# Altium schematic sheet clock_led.SchDoc
size A3
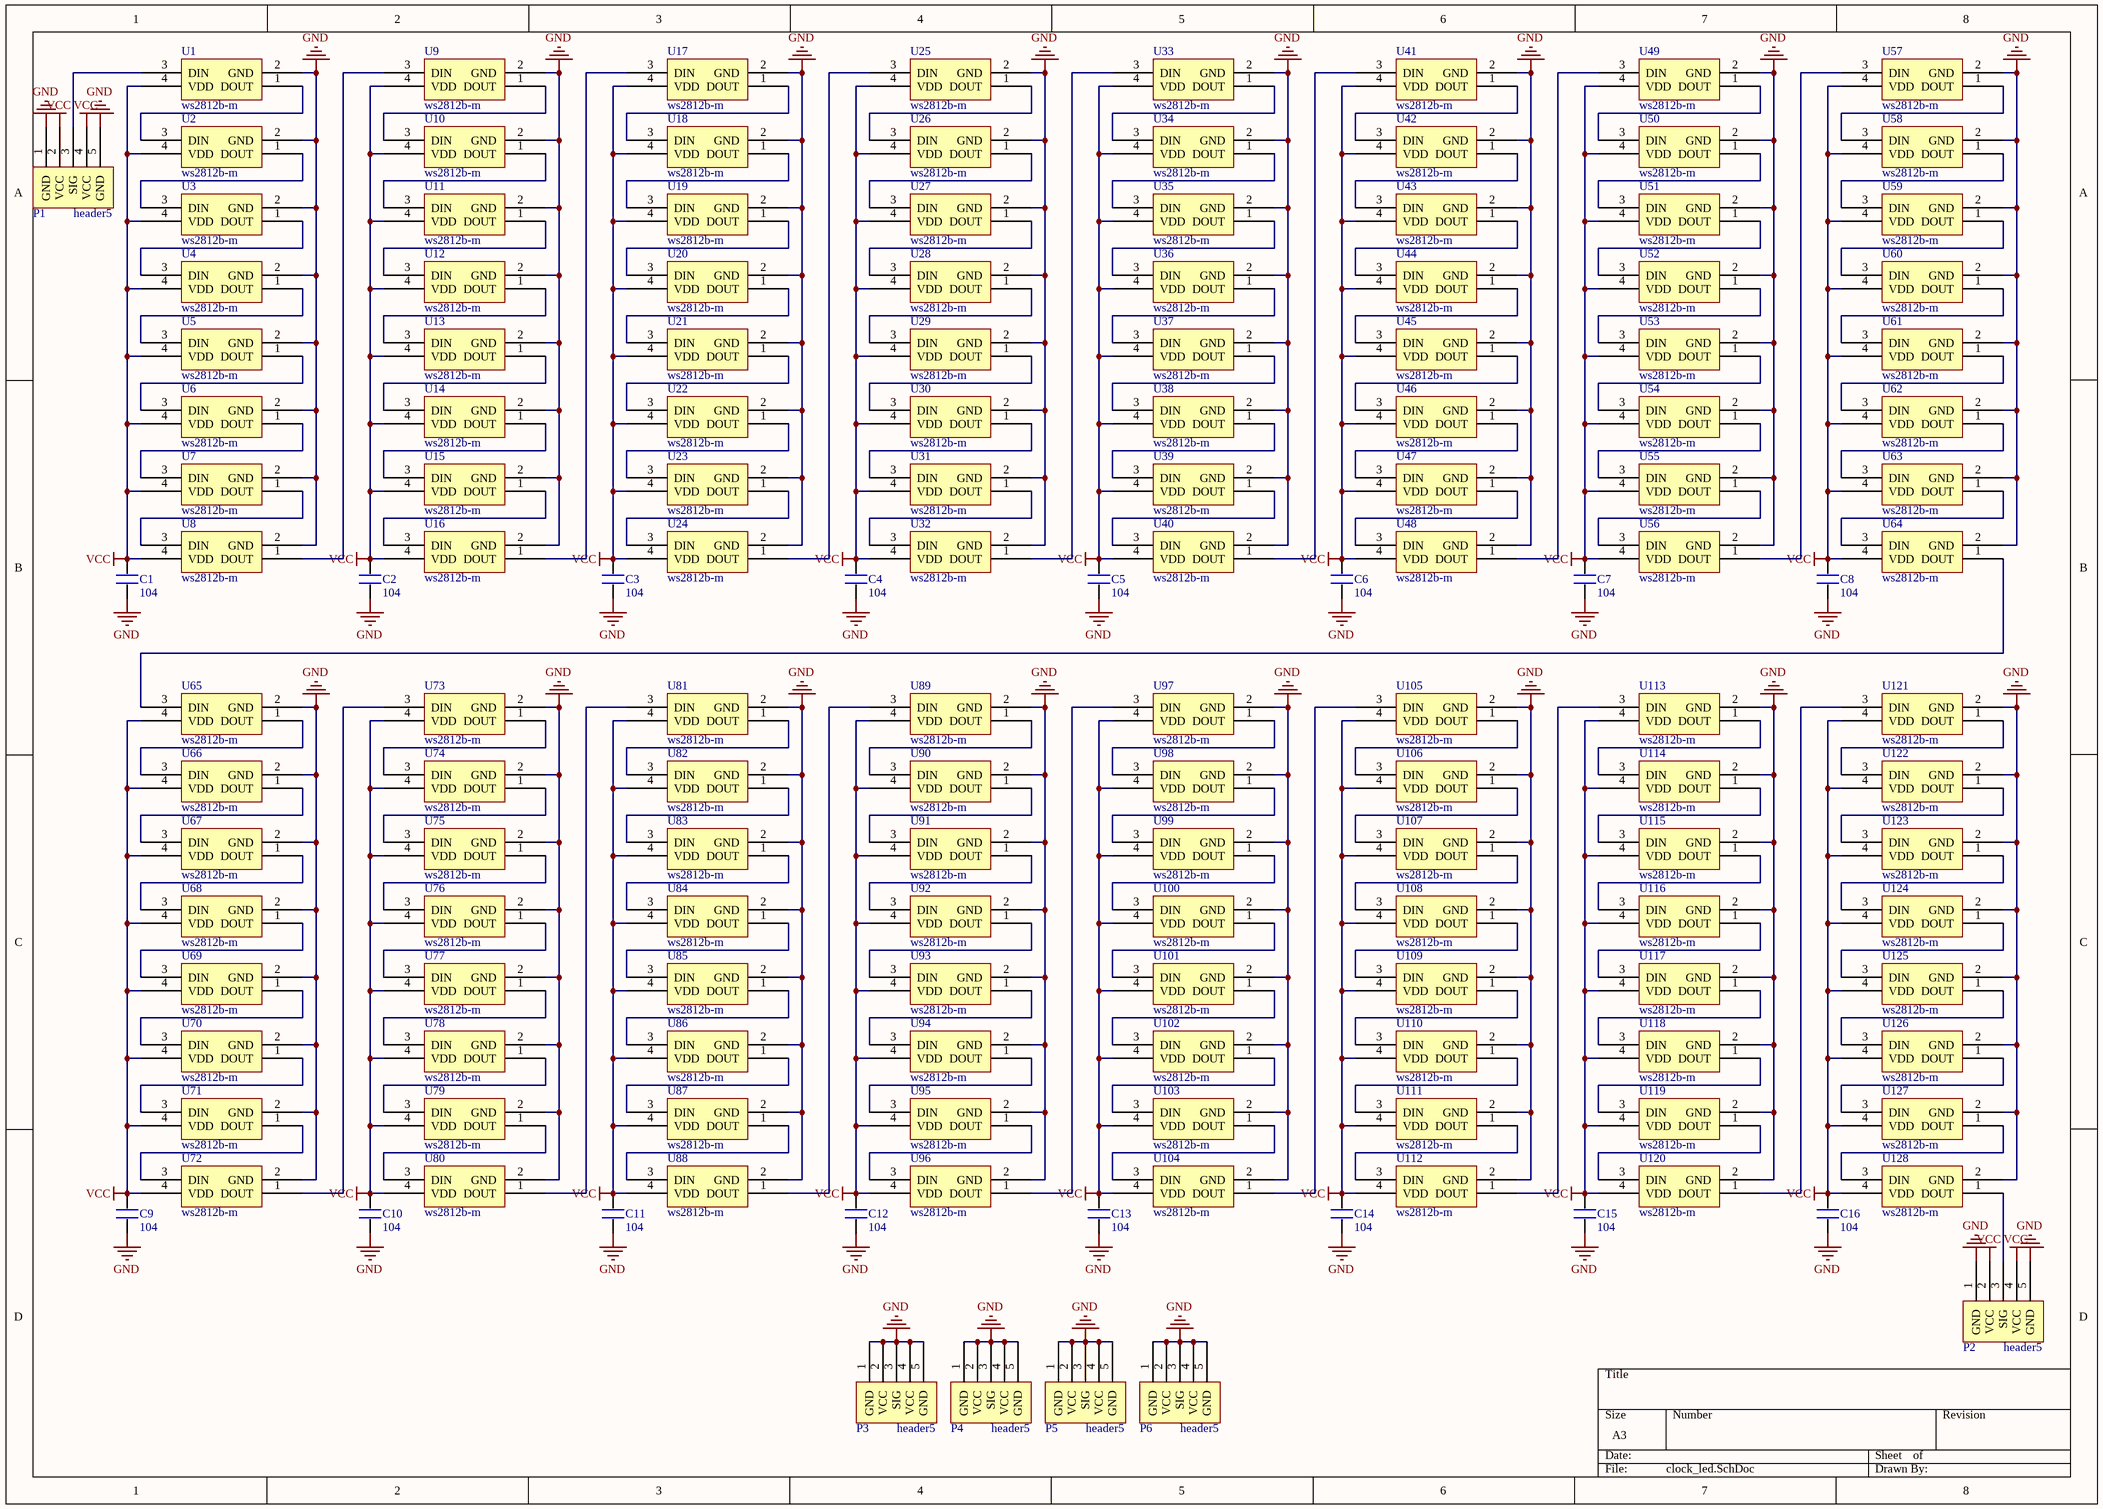
[diagram p0: clock_led.SchDoc]

## Parts
C1  104  [0603P]
C2  104  [0603P]
C3  104  [0603P]
C4  104  [0603P]
C5  104  [0603P]
C6  104  [0603P]
C7  104  [0603P]
C8  104  [0603P]
C9  104  [0603P]
C10  104  [0603P]
C11  104  [0603P]
C12  104  [0603P]
C13  104  [0603P]
C14  104  [0603P]
C15  104  [0603P]
C16  104  [0603P]
P1  header5  [header5]
P2  header5  [header5]
P3  header5  [header5]
P4  header5  [header5]
P5  header5  [header5]
P6  header5  [header5]
U1  ws2812b-m  [WS2812B-MINI]
U2  ws2812b-m  [WS2812B-MINI]
U3  ws2812b-m  [WS2812B-MINI]
U4  ws2812b-m  [WS2812B-MINI]
U5  ws2812b-m  [WS2812B-MINI]
U6  ws2812b-m  [WS2812B-MINI]
U7  ws2812b-m  [WS2812B-MINI]
U8  ws2812b-m  [WS2812B-MINI]
U9  ws2812b-m  [WS2812B-MINI]
U10  ws2812b-m  [WS2812B-MINI]
U11  ws2812b-m  [WS2812B-MINI]
U12  ws2812b-m  [WS2812B-MINI]
U13  ws2812b-m  [WS2812B-MINI]
U14  ws2812b-m  [WS2812B-MINI]
U15  ws2812b-m  [WS2812B-MINI]
U16  ws2812b-m  [WS2812B-MINI]
U17  ws2812b-m  [WS2812B-MINI]
U18  ws2812b-m  [WS2812B-MINI]
U19  ws2812b-m  [WS2812B-MINI]
U20  ws2812b-m  [WS2812B-MINI]
U21  ws2812b-m  [WS2812B-MINI]
U22  ws2812b-m  [WS2812B-MINI]
U23  ws2812b-m  [WS2812B-MINI]
U24  ws2812b-m  [WS2812B-MINI]
U25  ws2812b-m  [WS2812B-MINI]
U26  ws2812b-m  [WS2812B-MINI]
U27  ws2812b-m  [WS2812B-MINI]
U28  ws2812b-m  [WS2812B-MINI]
U29  ws2812b-m  [WS2812B-MINI]
U30  ws2812b-m  [WS2812B-MINI]
U31  ws2812b-m  [WS2812B-MINI]
U32  ws2812b-m  [WS2812B-MINI]
U33  ws2812b-m  [WS2812B-MINI]
U34  ws2812b-m  [WS2812B-MINI]
U35  ws2812b-m  [WS2812B-MINI]
U36  ws2812b-m  [WS2812B-MINI]
U37  ws2812b-m  [WS2812B-MINI]
U38  ws2812b-m  [WS2812B-MINI]
U39  ws2812b-m  [WS2812B-MINI]
U40  ws2812b-m  [WS2812B-MINI]
U41  ws2812b-m  [WS2812B-MINI]
U42  ws2812b-m  [WS2812B-MINI]
U43  ws2812b-m  [WS2812B-MINI]
U44  ws2812b-m  [WS2812B-MINI]
U45  ws2812b-m  [WS2812B-MINI]
U46  ws2812b-m  [WS2812B-MINI]
U47  ws2812b-m  [WS2812B-MINI]
U48  ws2812b-m  [WS2812B-MINI]
U49  ws2812b-m  [WS2812B-MINI]
U50  ws2812b-m  [WS2812B-MINI]
U51  ws2812b-m  [WS2812B-MINI]
U52  ws2812b-m  [WS2812B-MINI]
U53  ws2812b-m  [WS2812B-MINI]
U54  ws2812b-m  [WS2812B-MINI]
U55  ws2812b-m  [WS2812B-MINI]
U56  ws2812b-m  [WS2812B-MINI]
U57  ws2812b-m  [WS2812B-MINI]
U58  ws2812b-m  [WS2812B-MINI]
U59  ws2812b-m  [WS2812B-MINI]
U60  ws2812b-m  [WS2812B-MINI]
U61  ws2812b-m  [WS2812B-MINI]
U62  ws2812b-m  [WS2812B-MINI]
U63  ws2812b-m  [WS2812B-MINI]
U64  ws2812b-m  [WS2812B-MINI]
U65  ws2812b-m  [WS2812B-MINI]
U66  ws2812b-m  [WS2812B-MINI]
U67  ws2812b-m  [WS2812B-MINI]
U68  ws2812b-m  [WS2812B-MINI]
U69  ws2812b-m  [WS2812B-MINI]
U70  ws2812b-m  [WS2812B-MINI]
U71  ws2812b-m  [WS2812B-MINI]
U72  ws2812b-m  [WS2812B-MINI]
U73  ws2812b-m  [WS2812B-MINI]
U74  ws2812b-m  [WS2812B-MINI]
U75  ws2812b-m  [WS2812B-MINI]
U76  ws2812b-m  [WS2812B-MINI]
U77  ws2812b-m  [WS2812B-MINI]
U78  ws2812b-m  [WS2812B-MINI]
U79  ws2812b-m  [WS2812B-MINI]
U80  ws2812b-m  [WS2812B-MINI]
U81  ws2812b-m  [WS2812B-MINI]
U82  ws2812b-m  [WS2812B-MINI]
U83  ws2812b-m  [WS2812B-MINI]
U84  ws2812b-m  [WS2812B-MINI]
U85  ws2812b-m  [WS2812B-MINI]
U86  ws2812b-m  [WS2812B-MINI]
U87  ws2812b-m  [WS2812B-MINI]
U88  ws2812b-m  [WS2812B-MINI]
U89  ws2812b-m  [WS2812B-MINI]
U90  ws2812b-m  [WS2812B-MINI]
U91  ws2812b-m  [WS2812B-MINI]
U92  ws2812b-m  [WS2812B-MINI]
U93  ws2812b-m  [WS2812B-MINI]
U94  ws2812b-m  [WS2812B-MINI]
U95  ws2812b-m  [WS2812B-MINI]
U96  ws2812b-m  [WS2812B-MINI]
U97  ws2812b-m  [WS2812B-MINI]
U98  ws2812b-m  [WS2812B-MINI]
U99  ws2812b-m  [WS2812B-MINI]
U100  ws2812b-m  [WS2812B-MINI]
U101  ws2812b-m  [WS2812B-MINI]
U102  ws2812b-m  [WS2812B-MINI]
U103  ws2812b-m  [WS2812B-MINI]
U104  ws2812b-m  [WS2812B-MINI]
U105  ws2812b-m  [WS2812B-MINI]
U106  ws2812b-m  [WS2812B-MINI]
U107  ws2812b-m  [WS2812B-MINI]
U108  ws2812b-m  [WS2812B-MINI]
U109  ws2812b-m  [WS2812B-MINI]
U110  ws2812b-m  [WS2812B-MINI]
U111  ws2812b-m  [WS2812B-MINI]
U112  ws2812b-m  [WS2812B-MINI]
U113  ws2812b-m  [WS2812B-MINI]
U114  ws2812b-m  [WS2812B-MINI]
U115  ws2812b-m  [WS2812B-MINI]
U116  ws2812b-m  [WS2812B-MINI]
U117  ws2812b-m  [WS2812B-MINI]
U118  ws2812b-m  [WS2812B-MINI]
U119  ws2812b-m  [WS2812B-MINI]
U120  ws2812b-m  [WS2812B-MINI]
U121  ws2812b-m  [WS2812B-MINI]
U122  ws2812b-m  [WS2812B-MINI]
U123  ws2812b-m  [WS2812B-MINI]
U124  ws2812b-m  [WS2812B-MINI]
U125  ws2812b-m  [WS2812B-MINI]
U126  ws2812b-m  [WS2812B-MINI]
U127  ws2812b-m  [WS2812B-MINI]
U128  ws2812b-m  [WS2812B-MINI]

## Nets
GND: C1.1 C2.1 C3.1 C4.1 C5.1 C6.1 C7.1 C8.1 C9.1 C10.1 C11.1 C12.1 C13.1 C14.1 C15.1 C16.1 P1.1(GND) P1.5(GND) P2.1(GND) P2.5(GND) P3.1(GND) P3.2(VCC) P3.3(SIG) P3.4(VCC) P3.5(GND) P4.1(GND) P4.2(VCC) P4.3(SIG) P4.4(VCC) P4.5(GND) P5.1(GND) P5.2(VCC) P5.3(SIG) P5.4(VCC) P5.5(GND) P6.1(GND) P6.2(VCC) P6.3(SIG) P6.4(VCC) P6.5(GND) U1.2(GND) U2.2(GND) U3.2(GND) U4.2(GND) U5.2(GND) U6.2(GND) U7.2(GND) U8.2(GND) U9.2(GND) U10.2(GND) U11.2(GND) U12.2(GND) U13.2(GND) U14.2(GND) U15.2(GND) U16.2(GND) U17.2(GND) U18.2(GND) U19.2(GND) U20.2(GND) U21.2(GND) U22.2(GND) U23.2(GND) U24.2(GND) U25.2(GND) U26.2(GND) U27.2(GND) U28.2(GND) U29.2(GND) U30.2(GND) U31.2(GND) U32.2(GND) U33.2(GND) U34.2(GND) U35.2(GND) U36.2(GND) U37.2(GND) U38.2(GND) U39.2(GND) U40.2(GND) U41.2(GND) U42.2(GND) U43.2(GND) U44.2(GND) U45.2(GND) U46.2(GND) U47.2(GND) U48.2(GND) U49.2(GND) U50.2(GND) U51.2(GND) U52.2(GND) U53.2(GND) U54.2(GND) U55.2(GND) U56.2(GND) U57.2(GND) U58.2(GND) U59.2(GND) U60.2(GND) U61.2(GND) U62.2(GND) U63.2(GND) U64.2(GND) U65.2(GND) U66.2(GND) U67.2(GND) U68.2(GND) U69.2(GND) U70.2(GND) U71.2(GND) U72.2(GND) U73.2(GND) U74.2(GND) U75.2(GND) U76.2(GND) U77.2(GND) U78.2(GND) U79.2(GND) U80.2(GND) U81.2(GND) U82.2(GND) U83.2(GND) U84.2(GND) U85.2(GND) U86.2(GND) U87.2(GND) U88.2(GND) U89.2(GND) U90.2(GND) U91.2(GND) U92.2(GND) U93.2(GND) U94.2(GND) U95.2(GND) U96.2(GND) U97.2(GND) U98.2(GND) U99.2(GND) U100.2(GND) U101.2(GND) U102.2(GND) U103.2(GND) U104.2(GND) U105.2(GND) U106.2(GND) U107.2(GND) U108.2(GND) U109.2(GND) U110.2(GND) U111.2(GND) U112.2(GND) U113.2(GND) U114.2(GND) U115.2(GND) U116.2(GND) U117.2(GND) U118.2(GND) U119.2(GND) U120.2(GND) U121.2(GND) U122.2(GND) U123.2(GND) U124.2(GND) U125.2(GND) U126.2(GND) U127.2(GND) U128.2(GND)
VCC: C1.2 C2.2 C3.2 C4.2 C5.2 C6.2 C7.2 C8.2 C9.2 C10.2 C11.2 C12.2 C13.2 C14.2 C15.2 C16.2 P1.2(VCC) P1.4(VCC) P2.2(VCC) P2.4(VCC) U1.4(VDD) U2.4(VDD) U3.4(VDD) U4.4(VDD) U5.4(VDD) U6.4(VDD) U7.4(VDD) U8.4(VDD) U9.4(VDD) U10.4(VDD) U11.4(VDD) U12.4(VDD) U13.4(VDD) U14.4(VDD) U15.4(VDD) U16.4(VDD) U17.4(VDD) U18.4(VDD) U19.4(VDD) U20.4(VDD) U21.4(VDD) U22.4(VDD) U23.4(VDD) U24.4(VDD) U25.4(VDD) U26.4(VDD) U27.4(VDD) U28.4(VDD) U29.4(VDD) U30.4(VDD) U31.4(VDD) U32.4(VDD) U33.4(VDD) U34.4(VDD) U35.4(VDD) U36.4(VDD) U37.4(VDD) U38.4(VDD) U39.4(VDD) U40.4(VDD) U41.4(VDD) U42.4(VDD) U43.4(VDD) U44.4(VDD) U45.4(VDD) U46.4(VDD) U47.4(VDD) U48.4(VDD) U49.4(VDD) U50.4(VDD) U51.4(VDD) U52.4(VDD) U53.4(VDD) U54.4(VDD) U55.4(VDD) U56.4(VDD) U57.4(VDD) U58.4(VDD) U59.4(VDD) U60.4(VDD) U61.4(VDD) U62.4(VDD) U63.4(VDD) U64.4(VDD) U65.4(VDD) U66.4(VDD) U67.4(VDD) U68.4(VDD) U69.4(VDD) U70.4(VDD) U71.4(VDD) U72.4(VDD) U73.4(VDD) U74.4(VDD) U75.4(VDD) U76.4(VDD) U77.4(VDD) U78.4(VDD) U79.4(VDD) U80.4(VDD) U81.4(VDD) U82.4(VDD) U83.4(VDD) U84.4(VDD) U85.4(VDD) U86.4(VDD) U87.4(VDD) U88.4(VDD) U89.4(VDD) U90.4(VDD) U91.4(VDD) U92.4(VDD) U93.4(VDD) U94.4(VDD) U95.4(VDD) U96.4(VDD) U97.4(VDD) U98.4(VDD) U99.4(VDD) U100.4(VDD) U101.4(VDD) U102.4(VDD) U103.4(VDD) U104.4(VDD) U105.4(VDD) U106.4(VDD) U107.4(VDD) U108.4(VDD) U109.4(VDD) U110.4(VDD) U111.4(VDD) U112.4(VDD) U113.4(VDD) U114.4(VDD) U115.4(VDD) U116.4(VDD) U117.4(VDD) U118.4(VDD) U119.4(VDD) U120.4(VDD) U121.4(VDD) U122.4(VDD) U123.4(VDD) U124.4(VDD) U125.4(VDD) U126.4(VDD) U127.4(VDD) U128.4(VDD)
NetP1_3: P1.3(SIG) U1.3(DIN)
NetP2_3: P2.3(SIG) U128.1(DOUT)
NetU1_1: U1.1(DOUT) U2.3(DIN)
NetU2_1: U2.1(DOUT) U3.3(DIN)
NetU3_1: U3.1(DOUT) U4.3(DIN)
NetU4_1: U4.1(DOUT) U5.3(DIN)
NetU5_1: U5.1(DOUT) U6.3(DIN)
NetU6_1: U6.1(DOUT) U7.3(DIN)
NetU7_1: U7.1(DOUT) U8.3(DIN)
NetU8_1: U8.1(DOUT) U9.3(DIN)
NetU9_1: U9.1(DOUT) U10.3(DIN)
NetU10_1: U10.1(DOUT) U11.3(DIN)
NetU11_1: U11.1(DOUT) U12.3(DIN)
NetU12_1: U12.1(DOUT) U13.3(DIN)
NetU13_1: U13.1(DOUT) U14.3(DIN)
NetU14_1: U14.1(DOUT) U15.3(DIN)
NetU15_1: U15.1(DOUT) U16.3(DIN)
NetU16_1: U16.1(DOUT) U17.3(DIN)
NetU17_1: U17.1(DOUT) U18.3(DIN)
NetU18_1: U18.1(DOUT) U19.3(DIN)
NetU19_1: U19.1(DOUT) U20.3(DIN)
NetU20_1: U20.1(DOUT) U21.3(DIN)
NetU21_1: U21.1(DOUT) U22.3(DIN)
NetU22_1: U22.1(DOUT) U23.3(DIN)
NetU23_1: U23.1(DOUT) U24.3(DIN)
NetU24_1: U24.1(DOUT) U25.3(DIN)
NetU25_1: U25.1(DOUT) U26.3(DIN)
NetU26_1: U26.1(DOUT) U27.3(DIN)
NetU27_1: U27.1(DOUT) U28.3(DIN)
NetU28_1: U28.1(DOUT) U29.3(DIN)
NetU29_1: U29.1(DOUT) U30.3(DIN)
NetU30_1: U30.1(DOUT) U31.3(DIN)
NetU31_1: U31.1(DOUT) U32.3(DIN)
NetU32_1: U32.1(DOUT) U33.3(DIN)
NetU33_1: U33.1(DOUT) U34.3(DIN)
NetU34_1: U34.1(DOUT) U35.3(DIN)
NetU35_1: U35.1(DOUT) U36.3(DIN)
NetU36_1: U36.1(DOUT) U37.3(DIN)
NetU37_1: U37.1(DOUT) U38.3(DIN)
NetU38_1: U38.1(DOUT) U39.3(DIN)
NetU39_1: U39.1(DOUT) U40.3(DIN)
NetU40_1: U40.1(DOUT) U41.3(DIN)
NetU41_1: U41.1(DOUT) U42.3(DIN)
NetU42_1: U42.1(DOUT) U43.3(DIN)
NetU43_1: U43.1(DOUT) U44.3(DIN)
NetU44_1: U44.1(DOUT) U45.3(DIN)
NetU45_1: U45.1(DOUT) U46.3(DIN)
NetU46_1: U46.1(DOUT) U47.3(DIN)
NetU47_1: U47.1(DOUT) U48.3(DIN)
NetU48_1: U48.1(DOUT) U49.3(DIN)
NetU49_1: U49.1(DOUT) U50.3(DIN)
NetU50_1: U50.1(DOUT) U51.3(DIN)
NetU51_1: U51.1(DOUT) U52.3(DIN)
NetU52_1: U52.1(DOUT) U53.3(DIN)
NetU53_1: U53.1(DOUT) U54.3(DIN)
NetU54_1: U54.1(DOUT) U55.3(DIN)
NetU55_1: U55.1(DOUT) U56.3(DIN)
NetU56_1: U56.1(DOUT) U57.3(DIN)
NetU57_1: U57.1(DOUT) U58.3(DIN)
NetU58_1: U58.1(DOUT) U59.3(DIN)
NetU59_1: U59.1(DOUT) U60.3(DIN)
NetU60_1: U60.1(DOUT) U61.3(DIN)
NetU61_1: U61.1(DOUT) U62.3(DIN)
NetU62_1: U62.1(DOUT) U63.3(DIN)
NetU63_1: U63.1(DOUT) U64.3(DIN)
NetU64_1: U64.1(DOUT) U65.3(DIN)
NetU65_1: U65.1(DOUT) U66.3(DIN)
NetU66_1: U66.1(DOUT) U67.3(DIN)
NetU67_1: U67.1(DOUT) U68.3(DIN)
NetU68_1: U68.1(DOUT) U69.3(DIN)
NetU69_1: U69.1(DOUT) U70.3(DIN)
NetU70_1: U70.1(DOUT) U71.3(DIN)
NetU71_1: U71.1(DOUT) U72.3(DIN)
NetU72_1: U72.1(DOUT) U73.3(DIN)
NetU73_1: U73.1(DOUT) U74.3(DIN)
NetU74_1: U74.1(DOUT) U75.3(DIN)
NetU75_1: U75.1(DOUT) U76.3(DIN)
NetU76_1: U76.1(DOUT) U77.3(DIN)
NetU77_1: U77.1(DOUT) U78.3(DIN)
NetU78_1: U78.1(DOUT) U79.3(DIN)
NetU79_1: U79.1(DOUT) U80.3(DIN)
NetU80_1: U80.1(DOUT) U81.3(DIN)
NetU81_1: U81.1(DOUT) U82.3(DIN)
NetU82_1: U82.1(DOUT) U83.3(DIN)
NetU83_1: U83.1(DOUT) U84.3(DIN)
NetU84_1: U84.1(DOUT) U85.3(DIN)
NetU85_1: U85.1(DOUT) U86.3(DIN)
NetU86_1: U86.1(DOUT) U87.3(DIN)
NetU87_1: U87.1(DOUT) U88.3(DIN)
NetU88_1: U88.1(DOUT) U89.3(DIN)
NetU89_1: U89.1(DOUT) U90.3(DIN)
NetU90_1: U90.1(DOUT) U91.3(DIN)
NetU91_1: U91.1(DOUT) U92.3(DIN)
NetU92_1: U92.1(DOUT) U93.3(DIN)
NetU93_1: U93.1(DOUT) U94.3(DIN)
NetU94_1: U94.1(DOUT) U95.3(DIN)
NetU95_1: U95.1(DOUT) U96.3(DIN)
NetU96_1: U96.1(DOUT) U97.3(DIN)
NetU97_1: U97.1(DOUT) U98.3(DIN)
NetU98_1: U98.1(DOUT) U99.3(DIN)
NetU99_1: U99.1(DOUT) U100.3(DIN)
NetU100_1: U100.1(DOUT) U101.3(DIN)
NetU101_1: U101.1(DOUT) U102.3(DIN)
NetU102_1: U102.1(DOUT) U103.3(DIN)
NetU103_1: U103.1(DOUT) U104.3(DIN)
NetU104_1: U104.1(DOUT) U105.3(DIN)
NetU105_1: U105.1(DOUT) U106.3(DIN)
NetU106_1: U106.1(DOUT) U107.3(DIN)
NetU107_1: U107.1(DOUT) U108.3(DIN)
NetU108_1: U108.1(DOUT) U109.3(DIN)
NetU109_1: U109.1(DOUT) U110.3(DIN)
NetU110_1: U110.1(DOUT) U111.3(DIN)
NetU111_1: U111.1(DOUT) U112.3(DIN)
NetU112_1: U112.1(DOUT) U113.3(DIN)
NetU113_1: U113.1(DOUT) U114.3(DIN)
NetU114_1: U114.1(DOUT) U115.3(DIN)
NetU115_1: U115.1(DOUT) U116.3(DIN)
NetU116_1: U116.1(DOUT) U117.3(DIN)
NetU117_1: U117.1(DOUT) U118.3(DIN)
NetU118_1: U118.1(DOUT) U119.3(DIN)
NetU119_1: U119.1(DOUT) U120.3(DIN)
NetU120_1: U120.1(DOUT) U121.3(DIN)
NetU121_1: U121.1(DOUT) U122.3(DIN)
NetU122_1: U122.1(DOUT) U123.3(DIN)
NetU123_1: U123.1(DOUT) U124.3(DIN)
NetU124_1: U124.1(DOUT) U125.3(DIN)
NetU125_1: U125.1(DOUT) U126.3(DIN)
NetU126_1: U126.1(DOUT) U127.3(DIN)
NetU127_1: U127.1(DOUT) U128.3(DIN)

## Library data of the parts
C1-C16 = C
U1-U128 = WS2812B-MINI